# Altium schematic sheet Driver.SchDoc
size A4; Organization: Protel International P/L; Address1: L3, 12a Rodborough Rd; Address2: Frenchs Forest; Address3: NSW; Address4: Australia 2086
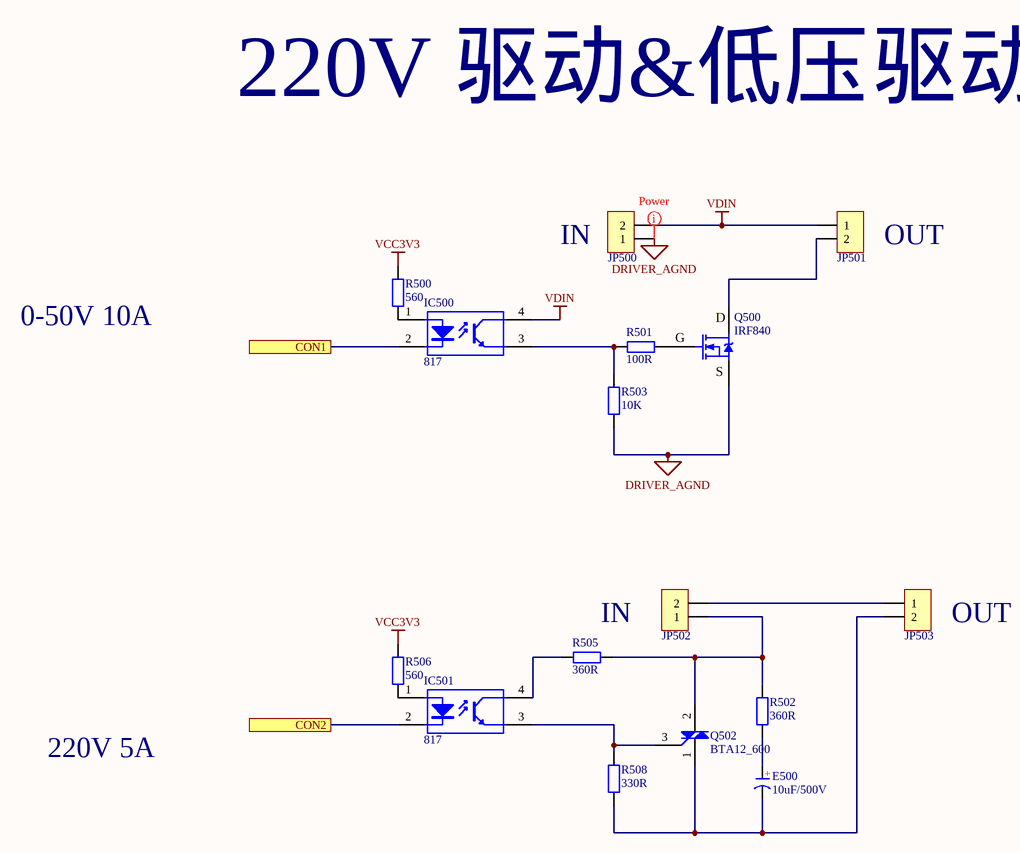
[diagram p0: Driver.SchDoc]

## Parts
E500  10uF/500V  [CS 2.0*5*8 - R]
IC500  817  [DIP4-300]
IC501  817  [DIP4-300]
JP500  HDR-1X2  [KF2EDGK5.0-LI-2P]  (value not drawn)
JP501  HDR-1X2  [KF2EDGK5.0-LI-2P]  (value not drawn)
JP502  HDR-1X2  [KF2EDGK5.0-LI-2P]  (value not drawn)
JP503  HDR-1X2  [KF2EDGK5.0-LI-2P]  (value not drawn)
Q500  IRF840  [TO220A]
Q502  BTA12_600  [TO252]
R500  560  [R 0402_M]
R501  100R  [R 0402_M]
R502  360R  [R 0402_M]
R503  10K  [R 0402_M]
R505  360R  [R 0402_M]
R506  560  [R 0402_M]
R508  330R  [R 0402_M]

## Ports
CON1, CON2

## Nets
DRIVER_AGND: JP500.1 Q500.3(S) R503.1
VCC3V3: R500.1 R506.1
VDIN: IC500.4(C) JP500.2 JP501.1
CON1: IC500.2(K) ; port CON1
CON2: IC501.2(K) ; port CON2
NetE500_1: E500.1(A) R502.2
NetE500_2: E500.2(K) JP503.2 Q502.1(A1) R508.1
NetIC500_1: IC500.1(A) R500.2
NetIC500_3: IC500.3(E) R501.1 R503.2
NetIC501_1: IC501.1(A) R506.2
NetIC501_3: IC501.3(E) Q502.3(G) R508.2
NetIC501_4: IC501.4(C) R505.2
NetJP501_2: JP501.2 Q500.2(D)
NetJP502_1: JP502.1 Q502.2(A2) R502.1 R505.1
NetJP502_2: JP502.2 JP503.1
NetQ500_1: Q500.1(G) R501.2

## Layout directives
net class Power: DRIVER_AGND

## Notes on the sheet
- 220V 驱动&低压驱动
- (near JP500) IN
- (near JP501) OUT
- 0-50V 10A
- (near R505) IN
- (near JP503) OUT
- 220V 5A
- Title
- Size:
- Date:
- A4
- Number:
- Time:
- Revision:
- Sheet
- of
- File:
- (in symbol C-CS) +

## Library data of the parts
E500 = C-CS: 直插固态电容; 版权归属: 源创客; BOM名称: 直插固态电容; 学习资源: www.ooocke.com
IC500 IC501 = 817: 线性光耦; 版权归属: 源创客; BOM名称: 线性光耦; 学习资源: www.ooocke.com
JP500 JP501 = Header 2: 2P接插件; 版权归属: 源创客; BOM名称: 2P接插件; 学习资源: www.ooocke.com
JP502 JP503 = Header 2: 2P接插件; pin to pad: 1>2 2>1; 版权归属: 源创客; BOM名称: 2P接插件; 学习资源: www.ooocke.com
Q500 = IRF840: N沟场效应管; 版权归属: 源创客; BOM名称: N沟场效应管; 学习资源: www.ooocke.com
Q502 = BTA12_600: 双向可控硅; 版权归属: 源创客; BOM名称: 双向可控硅; 学习资源: www.ooocke.com
R500-R503 R505 R506 R508 = R: 贴片电阻; 版权归属: 源创客; BOM名称: 贴片电阻; 学习资源: www.ooocke.com